# EAGLE design a (EAGLE 6.4)
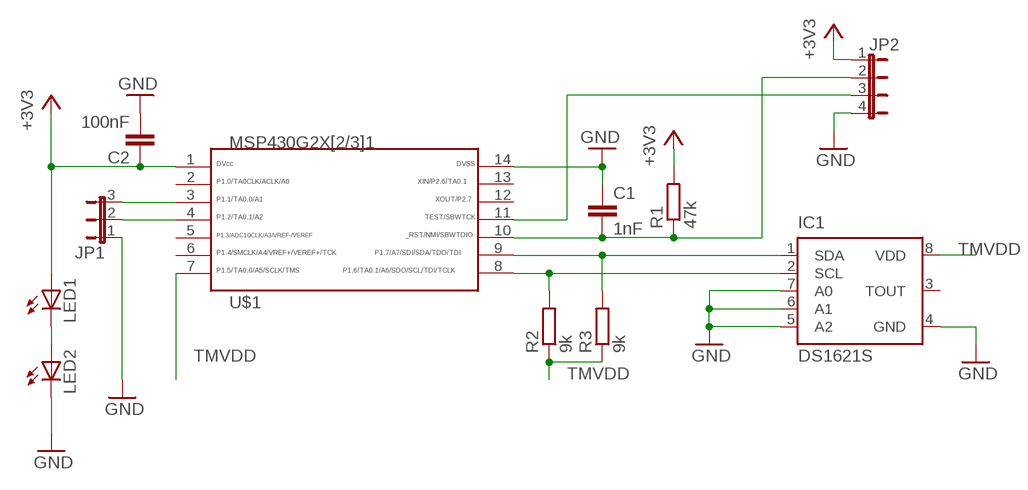
[diagram p0: schematic, sheet 1]

## Parts
C1  1nF  C-EUC0603K  [C0603K]
C2  100nF  C-EUC1206K  [C1206K]
IC1  DS1621S  [SO08]
JP1  JP2E  [JP2]
JP2  JP4E  [JP4]
LED1  LED3MM  [LED3MM]
LED2  LED3MM  [LED3MM]
R1  47k  R-EU_R1206  [R1206]
R2  9k  R-EU_M0805  [M0805]
R3  9k  R-EU_M0805  [M0805]
U$1  G2X[2/3]1---PW14  [PW14]

## Nets
+3V3: C2.1 JP2.1 LED1.A R1.2 U$1.1
GND: C1.1 C2.2 IC1.4(GND) IC1.5(A2) IC1.6(A1) IC1.7(A0) JP1.1 JP2.4 LED2.K(C) U$1.14
N$1: LED1.K(C) LED2.A
N$2: IC1.2(SCL) R2.2 U$1.8
N$3: C1.2 JP2.2 R1.1 U$1.10
N$4: IC1.1(SDA) R3.2 U$1.9
N$5: JP1.3 U$1.3
N$6: JP1.2 U$1.4
N$7: JP2.3 U$1.11
TMVDD: IC1.8(VDD) R2.1 R3.1 U$1.7
Unconnected: IC1.3(TOUT) U$1.2 U$1.5 U$1.6 U$1.12 U$1.13

## Library data of the parts
C1 C2 = rcl:C-EU: CAPACITOR, European symbol
IC1 = maxim:DS1621: Digital Thermometer and Thermostat Source: http://pdfserv.maxim-ic.com/en/ds/DS1621.pdf; MF: DALLAS SEMICONDUCTOR; MPN: DS1621S+; OC_FARNELL: 9725261; OC_NEWARK: 23K3501
JP1 = jumper:JP2E: JUMPER
JP2 = jumper:JP4E: JUMPER
LED1 LED2 = led:LED: LED OSRAM: - CHIPLED LG R971, LG N971, LY N971, LG Q971, LY Q971, LO R971, LY R971 LH N974, LH R974 LS Q976, LO Q976, LY Q976 LO Q996 - Hyper CHIPLED LW Q18S LB Q993, LB Q99A, LB R99A - SideLED LS A670, LO A670, LY A670, LG A670, LP A670 LB A673, LV A673, LT A673, LW A673 LH A674 LY A675 LS A676, LA A676, LO A676, LY A676, LW A676 LS A679, LY A679, LG A679 - Hyper Micro SIDELED® LS Y876, LA Y876, LO Y876, LY Y876 LT Y87S - SmartLED LW L88C, LW L88S LB L89C, LB L89S, LG L890 LS L89K, LO L89K, LY L89K LS L896, LA L896, LO L896, LY L896 - TOPLED LS T670, LO T670, LY T670, LG T670, LP T670 LSG T670, LSP T670, LSY T670, LOP T670, LYG T670 LG T671, LOG T671, LSG T671 LB T673, LV T673, LT T673, LW T673 LH T674 LS T676, LA T676, LO T676, LY T676, LB T676, LH T676, LSB T676, LW T676 LB T67C, LV T67C, LT T67C, LS T67K, LO T67K, LY T67K, LW E67C LS E67B, LA E67B, LO E67B, LY E67B, LB E67C, LV E67C, LT E67C LW T67C LS T679, LY T679, LG T679 LS T770, LO T770, LY T770, LG T770, LP T770 LB T773, LV T773, LT T773, LW T773 LH T774 LS E675, LA E675, LY E675, LS T675 LS T776, LA T776, LO T776, LY T776, LB T776 LHGB T686 LT T68C, LB T68C - Hyper Mini TOPLED® LB M676 - Mini TOPLED Santana® LG M470 LS M47K, LO M47K, LY M47K Source: http://www.osram.convergy.de LUXEON: - LUMILED® LXK2-PW12-R00, LXK2-PW12-S00, LXK2-PW14-U00, LXK2-PW14-V00 LXK2-PM12-R00, LXK2-PM12-S00, LXK2-PM14-U00 LXK2-PE12-Q00, LXK2-PE12-R00, LXK2-PE12-S00, LXK2-PE14-T00, LXK2-PE14-U00 LXK2-PB12-K00, LXK2-PB12-L00, LXK2-PB12-M00, LXK2-PB14-N00, LXK2-PB14-P00, LXK2-PB14-Q00 LXK2-PR12-L00, LXK2-PR12-M00, LXK2-PR14-Q00, LXK2-PR14-R00 LXK2-PD12-Q00, LXK2-PD12-R00, LXK2-PD12-S00 LXK2-PH12-R00, LXK2-PH12-S00 LXK2-PL12-P00, LXK2-PL12-Q00, LXK2-PL12-R00 Source: www.luxeon.com KINGBRIGHT: KA-3528ASYC Source: www.kingbright.com
R1-R3 = rcl:R-EU_: RESISTOR, European symbol
U$1 = msp430g2x31:G2X[2/3]1---PW14: MSP430G2X[2/3]1 TSSOP (PW) 14 Pin Package http://focus.ti.com/docs/prod/folders/print/msp430g2221.html MSP430G2121, MSP430G2221, MSP430G2131

## Board
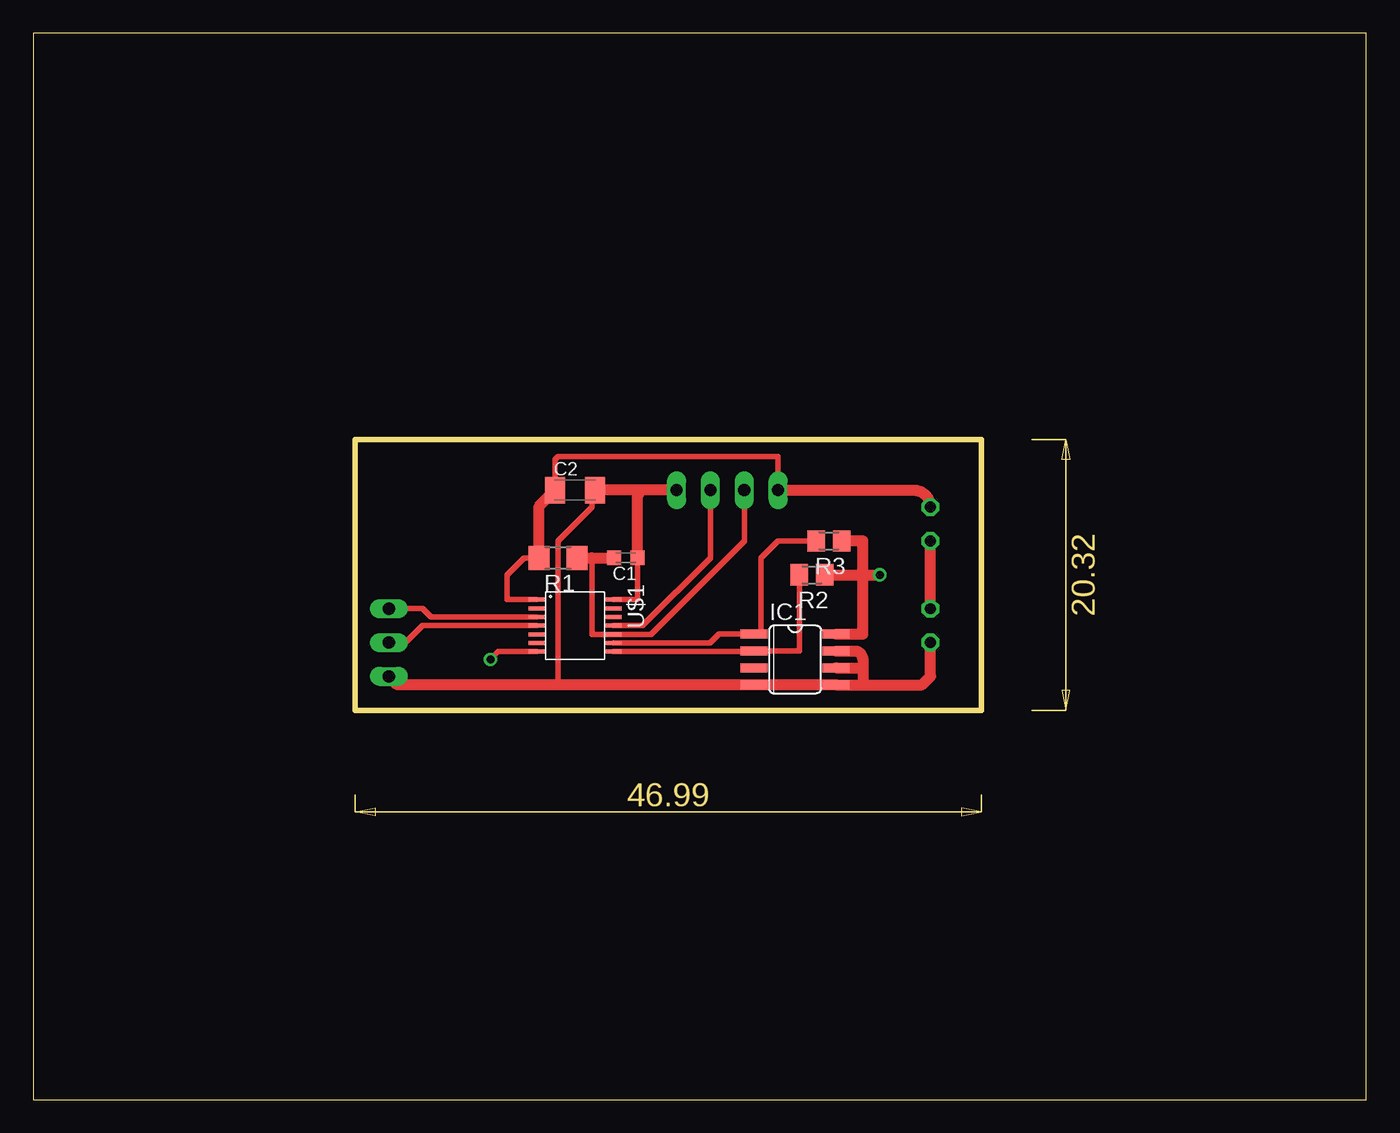
[diagram p1: board, top side]
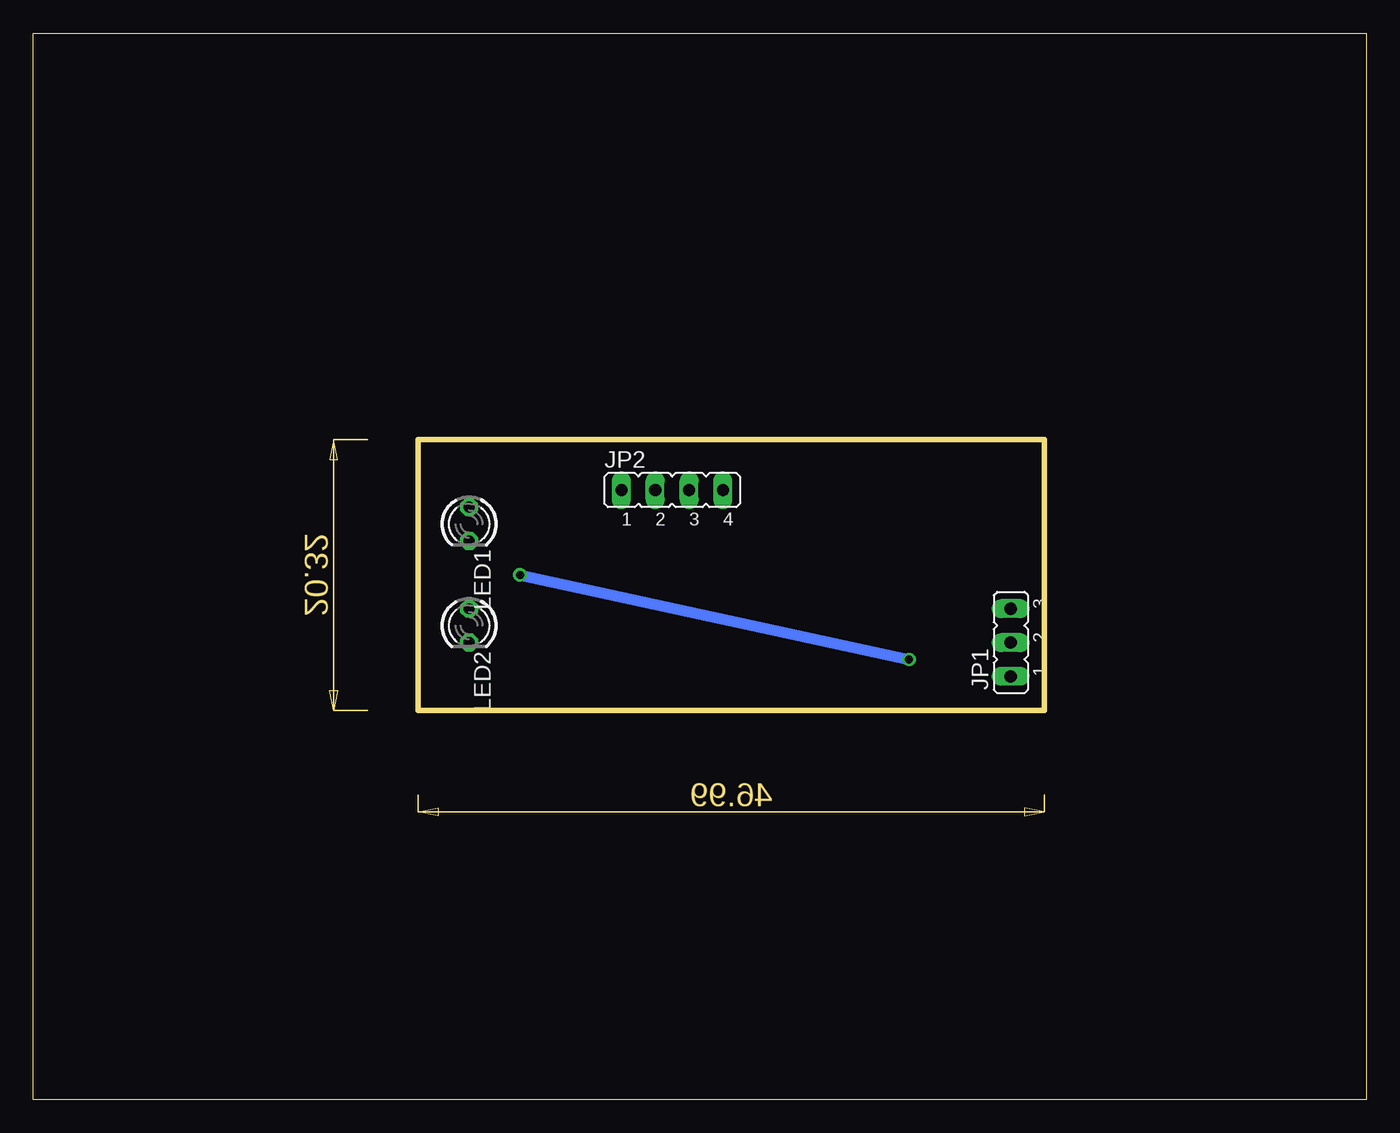
[diagram p2: board, bottom side, seen from below]

Size 100 x 80 mm. Coordinates in mm from the lower left corner, seen from the top.
Outline: 0,0 100,0 100,80 0,80 0,0
Outline: 71.12,29.21 71.12,49.53 24.13,49.53 24.13,29.21 71.12,29.21
Copper layers (1*16): Top 0.035mm / dielectric 1.5mm / Bottom 0.035mm
Design rules "default": minimum track width 10mil, minimum drill 24mil, track to track 8mil, track to pad 8mil, pad to pad 8mil, via to via 8mil, smd to smd 8mil, copper to edge 40mil, drill to drill 8mil, minimum pad ring 10mil, minimum via ring 8mil, stop-mask expansion 4mil, vias tented up to drill 0mil, thermal gap 10mil

### Footprints (pad centres in the part's own frame; a part is rotated, then mirrored left to right if it is on the bottom)
C0603K = smd 1.05 x 1.08: 1 -0.875,0; 2 0.875,0
C1206K = smd 1.5 x 2: 1 -1.5,0; 2 1.5,0
SO08 = smd 0.66 x 2.032: 1 -1.905,-3.073; 2 -0.635,-3.073; 3 0.635,-3.073; 4 1.905,-3.073; 5 1.905,3.073; 6 0.635,3.073; 7 -0.635,3.073; 8 -1.905,3.073
JP2 = drill 0.914 long: 1 -2.54,0; 2 0,0; 3 2.54,0
JP4 = drill 0.914 long: 1 -3.81,0; 2 -1.27,0; 3 1.27,0; 4 3.81,0
LED3MM = drill 0.813 octagon: A -1.27,0; K 1.27,0
R1206 = smd 1.6 x 1.803: 1 -1.422,0; 2 1.422,0
M0805 = smd 1.3 x 1.6: 1 -0.95,0; 2 0.95,0
PW14 = smd 0.3 x 1.2: 1 -1.95,-2.9; 2 -1.3,-2.9; 3 -0.65,-2.9; 4 0,-2.9; 5 0.65,-2.9; 6 1.3,-2.9; 7 1.95,-2.9; 8 1.95,2.9; 9 1.3,2.9; 10 0.65,2.9; 11 0,2.9; 12 -0.65,2.9; 13 -1.3,2.9; 14 -1.95,2.9

### Placement (x,y rotation side)
C1  44.45,40.64 180 top
C2  40.64,45.72 0 top
IC1  57.15,33.02 270 top
JP1  26.67,34.29 90 bottom
JP2  52.07,45.72 0 bottom
LED1  67.31,43.18 270 bottom
LED2  67.31,35.56 270 bottom
R1  39.37,40.64 180 top
R2  58.42,39.37 180 top
R3  59.69,41.91 180 top
U$1  40.64,35.56 270 top

### Tracks (layer width: path | path; a pad name or v marks a point on that pad's centre or on a via)
+3V3
  Top 0.406: JP2.1 55.88,48.26 39.37,48.26 39.14,48.03 C2.1 | U$1.1 35.56,37.51 35.56,39.37 36.83,40.64 R1.2
  Top 0.813: JP2.1 66.04,45.72 arc-90 LED1.A | R1.2 37.95,44.53 C2.1
GND
  Top 0.406: U$1.14 45.33,37.51 C1.1 | IC1.4 39.37,31.11 39.37,41.91 41.91,44.45 41.91,45.49 C2.2
  Top 0.813: JP2.4 45.72,45.72 | 45.72,45.72 C2.2 | 62.23,31.11 IC1.5 IC1.4 27.3,31.11 JP1.1 | 62.23,31.11 66.67,31.11 67.31,31.75 LED2.K | IC1.7 61.59,33.66 arc-90 62.23,33.02 62.23,32.38 | IC1.6 62.23,32.38 | 62.23,32.38 62.23,31.11 | C1.1 45.33,45.33 45.72,45.72
N$1
  Top 0.813: LED2.A LED1.K
N$2
  Top 0.406: U$1.8 54.03,33.61 IC1.2 57.47,33.66 R2.2
N$3
  Top 0.406: JP2.2 53.34,41.91 46.34,34.91 U$1.10 41.91,34.91 41.91,40.64
  Top 0.813: R1.1 41.91,40.64 C1.2
N$4
  Top 0.406: U$1.9 50.77,34.26 51.44,34.92 IC1.1 54.61,34.92 54.61,40.64 55.88,41.91 R3.2
N$5
  Top 0.406: U$1.3 29.83,36.21 29.21,36.83 JP1.3
N$6
  Top 0.406: U$1.4 29.21,35.56 27.94,34.29 JP1.2
N$7
  Top 0.406: U$1.11 45.72,35.56 50.8,40.64 JP2.3
N$8  (via drill 0.6)
  other vias: 63.5,39.37
TMVDD  (via drill 0.6)
  Top 0.406: U$1.7 34.88,33.61 v34.29,33.02
  Top 0.813: IC1.8 62.23,34.92 62.23,39.37 | 62.23,39.37 62.23,41.91 R3.1 | 62.23,39.37 R2.1 v63.5,39.37
  Bottom 0.813: v63.5,39.37 v34.29,33.02